# Altium schematic sheet 贴锁设置板201106.SchDoc
size A4
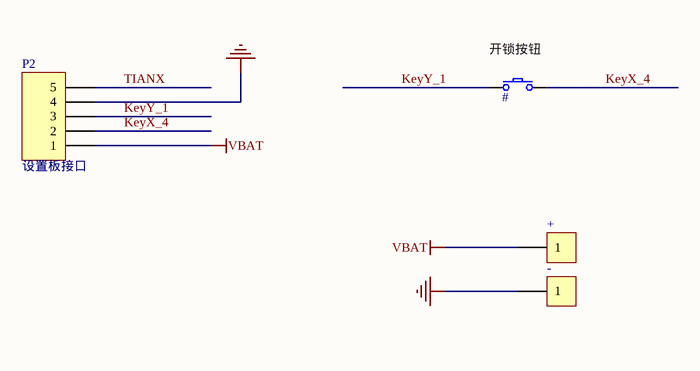
[diagram p0: 贴锁设置板201106.SchDoc]

## Parts
#  SW  [SW3]  (value not drawn)
+  (no value)  [hanpan]
-  (no value)  [hanpan]
P2  设置板接口  [5P-1.25mm]

## Nets
GND: -.1 P2.4
VBAT: +.1 P2.1
KeyX_4: #.2 P2.2
KeyY_1: #.1 P2.3
TIANX: P2.5

## Notes on the sheet
- (near #) 开锁按钮

## Library data of the parts
# = SW: Switch
+ - = Header 1: Header, 1-Pin; LatestRevisionDate: 17-Jul-2002; LatestRevisionNote: Re-released for DXP Platform.; Publisher: Altium Limited
P2 = Header 5: Header, 5-Pin; LatestRevisionDate: 17-Jul-2002; LatestRevisionNote: Re-released for DXP Platform.; Publisher: Altium Limited